# EAGLE design 4-Channel Lora Relay-10A v2.0 (EAGLE 6.1)
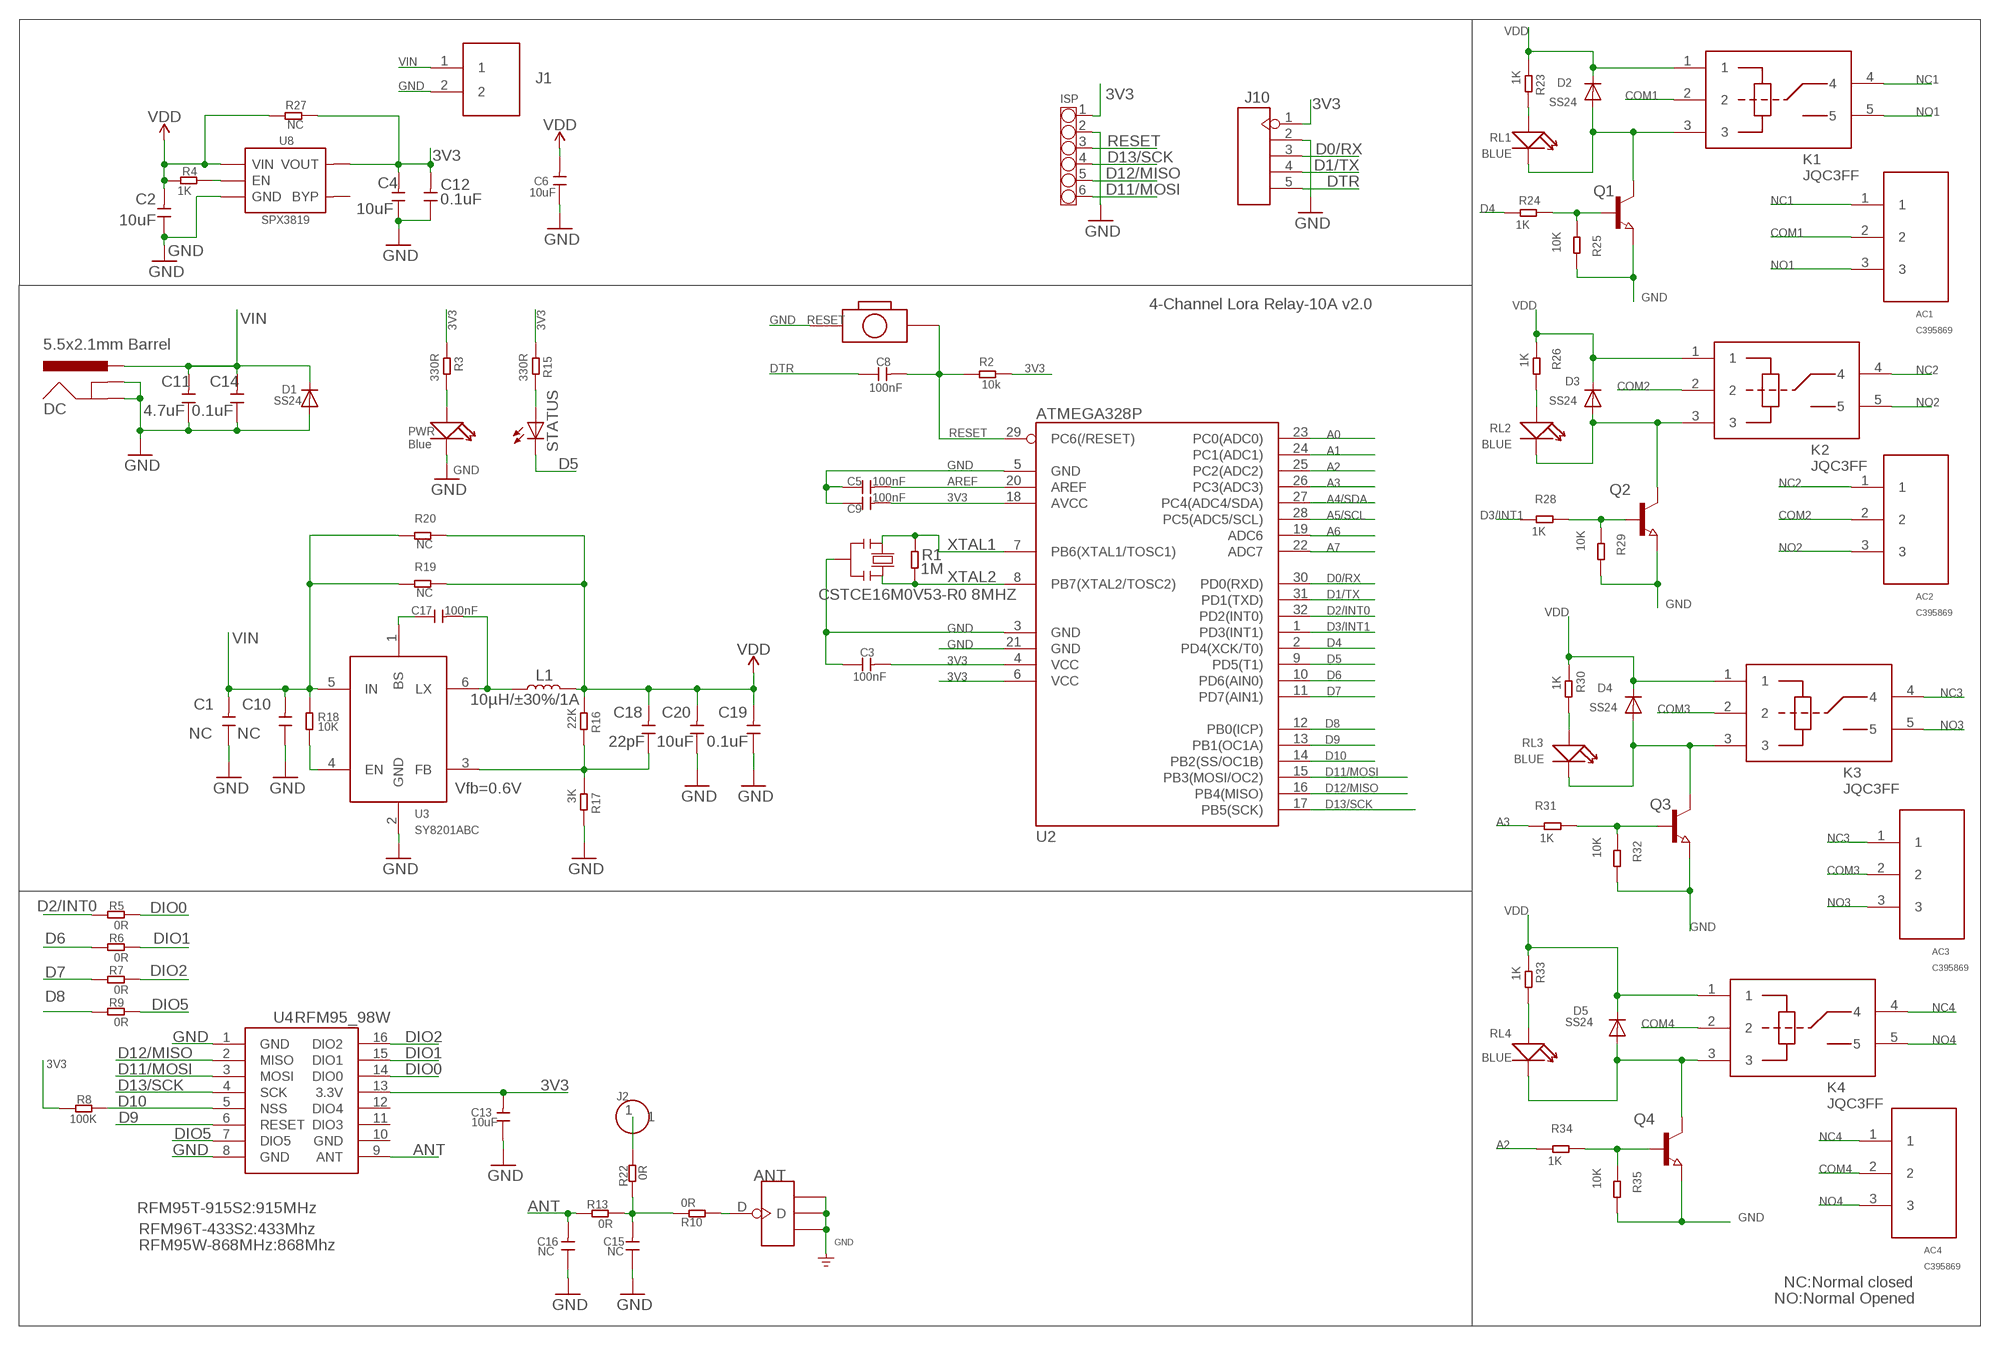
[diagram p0: schematic, sheet 1]

## Parts
AC1  C395869  [PIN_3P]
AC2  C395869  [PIN_3P]
AC3  C395869  [PIN_3P]
AC4  C395869  [PIN_3P]
ANT  ANTENNA-U-FL  [4P-U-FL]
C1  NC  C-0603  [0603]
C2  10uF  C-0603  [0603]
C3  100nF  C-0603  [0603]
C4  10uF  C-0603  [0603]
C5  100nF  C-0603  [0603]
C6  10uF  C-0603  [0603]
C8  100nF  C-0603  [0603]
C9  100nF  C-0603  [0603]
C10  NC  C-0603  [0603]
C11  4.7uF  C-0603  [0603]
C12  0.1uF  C-0603  [0603]
C13  10uF  C-0603  [0603]
C14  0.1uF  C-0603  [0603]
C15  NC  C-0603  [0603]
C16  NC  C-0603  [0603]
C17  100nF  C-0603  [0603]
C18  22pF  C-0603  [0603]
C19  0.1uF  C-0603  [0603]
C20  10uF  C-0603  [0603]
D1  SS24  DIODESMA  [SMADIODE]
D2  SS24  DIODESMA  [SMADIODE]
D3  SS24  DIODESMA  [SMADIODE]
D4  SS24  DIODESMA  [SMADIODE]
D5  SS24  DIODESMA  [SMADIODE]
DC  5.5x2.1mm Barrel  POWER_JACKSMD  [POWER_JACK_SMD]
ISP  CONNECTOR-HEADER-6P-3460270P1  [1X6P-2.54-8.5-BLACK-FEMALE]
J1  PH2.0-2P-90-DIP  [PH2.0-2P-90-DIP]
J2  HEADER-1P-50  [1P-100/50MIL]
J10  HEADER-5P-2.54  [5P-2.54]
K1  JQC3FF  [DIP5_JQC3FF]
K2  JQC3FF  [DIP5_JQC3FF]
K3  JQC3FF  [DIP5_JQC3FF]
K4  JQC3FF  [DIP5_JQC3FF]
L1  10µH/±30%/1A  INDUCTOR-CR54-47UH  [CR54]
PWR  Blue  LED'0603'  [LED-0603]
Q1  NPN-TRANSISTOR_SOT23  [SOT23]
Q2  NPN-TRANSISTOR_SOT23  [SOT23]
Q3  NPN-TRANSISTOR_SOT23  [SOT23]
Q4  NPN-TRANSISTOR_SOT23  [SOT23]
R1  1M  R-0603  [R0603]
R2  10k  R-0603  [R0603]
R3  330R  R-0603  [R0603]
R4  1K  R-0603  [R0603]
R5  0R  R-0603  [R0603]
R6  0R  R-0603  [R0603]
R7  0R  R-0603  [R0603]
R8  100K  R-0603  [R0603]
R9  0R  R-0603  [R0603]
R10  0R  R-0603  [R0603]
R13  0R  R-0603  [R0603]
R15  330R  R-0603  [R0603]
R16  22K  R-0603  [R0603]
R17  3K  R-0603  [R0603]
R18  10K  R-0603  [R0603]
R19  NC  R-0603  [R0603]
R20  NC  R-0603  [R0603]
R22  0R  R-0603  [R0603]
R23  1K  R-0603  [R0603]
R24  1K  R-0603  [R0603]
R25  10K  R-0603  [R0603]
R26  1K  R-0603  [R0603]
R27  NC  R-0603  [R0603]
R28  1K  R-0603  [R0603]
R29  10K  R-0603  [R0603]
R30  1K  R-0603  [R0603]
R31  1K  R-0603  [R0603]
R32  10K  R-0603  [R0603]
R33  1K  R-0603  [R0603]
R34  1K  R-0603  [R0603]
R35  10K  R-0603  [R0603]
RESET  BOTTON-2P-90D  [2P-7.62X3.56-90D]
RL1  BLUE  LED'0603'  [LED-0603]
RL2  BLUE  LED'0603'  [LED-0603]
RL3  BLUE  LED'0603'  [LED-0603]
RL4  BLUE  LED'0603'  [LED-0603]
STATUS  LED5MM  [LED5MM]
U2  ATMEGA328P  ATMEGA8/168/328  [TQFP32]
U3  SY8201ABC  [SOT-23-6]
U4  RFM95_98W  RFM92_93W  [RFM92_93W]
U8  SPX3819  [SOT23-5]
Y1  CSTCE16M0V53-R0 8MHZ  RESONATORMU  [RESONATOR]

## Nets
3V3: C3.2 C4.2 C9.2 C12.2 C13.2 ISP.1 J10.1 R2.1 R3.1 R8.2 R15.1 R27.2 U2.4(VCC) U2.6(VCC) U2.18(AVCC) U4.13(3.3V) U8.5(VOUT)
A0: U2.23(PC0(ADC0))
A1: U2.24(PC1(ADC1))
A2: R34.1 U2.25(PC2(ADC2))
A3: R31.1 U2.26(PC3(ADC3))
A4/SDA: U2.27(PC4(ADC4/SDA))
A5/SCL: U2.28(PC5(ADC5/SCL))
A6: U2.19(ADC6)
A7: U2.22(ADC7)
ANT: C16.2 R13.2 U4.9(ANT)
AREF: C5.2 U2.20(AREF)
COM1: AC1.2 K1.2
COM2: AC2.2 K2.2
COM3: AC3.2 K3.2
COM4: AC4.2 K4.2
D0/RX: J10.3 U2.30(PD0(RXD))
D1/TX: J10.4 U2.31(PD1(TXD))
D2/INT0: R5.1 U2.32(PD2(INT0))
D3/INT1: R28.1 U2.1(PD3(INT1))
D4: R24.1 U2.2(PD4(XCK/T0))
D5: STATUS.K(C) U2.9(PD5(T1))
D6: R6.1 U2.10(PD6(AIN0))
D7: R7.1 U2.11(PD7(AIN1))
D8: R9.1 U2.12(PB0(ICP))
D9: U2.13(PB1(OC1A)) U4.6(RESET)
D10: R8.1 U2.14(PB2(SS/OC1B)) U4.5(NSS)
D11/MOSI: ISP.6 U2.15(PB3(MOSI/OC2)) U4.3(MOSI)
D12/MISO: ISP.5 U2.16(PB4(MISO)) U4.2(MISO)
D13/SCK: ISP.4 U2.17(PB5(SCK)) U4.4(SCK)
DIO0: R5.2 U4.14(DIO0)
DIO1: R6.2 U4.15(DIO1)
DIO2: R7.2 U4.16(DIO2)
DIO5: R9.2 U4.7(DIO5)
DTR: C8.1 J10.5
GND: ANT.GND1 ANT.GND2 ANT.GND3 C1.1 C2.1 C3.1 C4.1 C5.1 C6.1 C9.1 C10.1 C11.1 C12.1 C13.1 C14.1 C15.1 C16.1 C19.1 C20.1 D1.A DC.GND(GNDBREAK) DC.P$4(GND) ISP.2 J1.2 J10.2 PWR.- Q1.2(E) Q2.2(E) Q3.2(E) Q4.2(E) R17.2 R25.2 R29.2 R32.2 R35.2 RESET.P$1 U2.3(GND) U2.5(GND) U2.21(GND) U3.2(GND) U4.1(GND) U4.8(GND) U8.2(GND) Y1.2
N$1: ANT.D R10.2
N$3: R23.2 RL1.+
N$4: C15.2 R10.1 R13.1 R22.2
N$5: R15.2 STATUS.A
N$6: C17.2 L1.P$1 U3.6(LX)
N$7: PWR.+ R3.2
N$8: C17.1 U3.1(BS)
N$9: D2.A K1.3 Q1.3(C) RL1.-
N$10: C18.1 R16.2 R17.1 U3.3(FB)
N$11: R18.2 U3.4(EN)
N$12: J2.1 R22.1
N$14: Q1.1(B) R24.2 R25.1
N$20: R26.2 RL2.+
N$21: D3.A K2.3 Q2.3(C) RL2.-
N$23: Q2.1(B) R28.2 R29.1
N$24: R4.2 U8.3(EN)
N$35: R30.2 RL3.+
N$36: D4.A K3.3 Q3.3(C) RL3.-
N$38: Q3.1(B) R31.2 R32.1
N$47: R33.2 RL4.+
N$48: D5.A K4.3 Q4.3(C) RL4.-
N$53: Q4.1(B) R34.2 R35.1
NC1: AC1.1 K1.4
NC2: AC2.1 K2.4
NC3: AC3.1 K3.4
NC4: AC4.1 K4.4
NO1: AC1.3 K1.5
NO2: AC2.3 K2.5
NO3: AC3.3 K3.5
NO4: AC4.3 K4.5
RESET: C8.2 ISP.3 R2.2 RESET.P$2 U2.29(PC6(/RESET))
VDD: C2.2 C6.2 C18.2 C19.2 C20.2 D2.C D3.C D4.C D5.C K1.1 K2.1 K3.1 K4.1 L1.P$2 R4.1 R16.1 R19.2 R20.2 R23.1 R26.1 R27.1 R30.1 R33.1 U8.1(VIN)
VIN: C1.2 C10.2 C11.2 C14.2 D1.C DC.VIN0(PWR) J1.1 R18.1 R19.1 R20.1 U3.5(IN)
XTAL1: R1.2 U2.7(PB6(XTAL1/TOSC1)) Y1.1
XTAL2: R1.1 U2.8(PB7(XTAL2/TOSC2)) Y1.3
Unconnected: U4.11(DIO3) U4.12(DIO4) U8.4(BYP)

## Notes on the sheet
- J1
- 4-Channel Lora Relay-10A v2.0
- Vfb=0.6V
- RFM95T-915S2:915MHz
- RFM96T-433S2:433Mhz
- RFM95W-868MHz:868Mhz
- NC:Normal closed
- NO:Normal Opened

## Power pins joined to a net without a drawn wire
GND: U4.10(GND)

## Library data of the parts
AC1-AC4 = 1mytest:C395869
ANT = Connector:ANTENNA-U-FL
C1-C6 C8-C20 = Discrete:C*: Ceramic Capacitors
D1-D5 = adafruit:DIODE: Diode SMADIODE - SMA Surface Mount Package 20V 1A Schottky Diode Digikey: 641-1014-6-ND DO-1N4148 - Through Hole Small Current Diode SOD-123 20V 1 A (.5mV Vf) Schottky Diode - Digikey: MBRX120TPMSCT-ND SOD-323 10V 570mA (.38mV Vf, 3ns) Schottky Diode - Digikey: ZLLS410CT-ND SOD-523 30V 30mA Schottky Diode (RB751S-40TE61) - Digikey: RB751S-40TE61CT-ND SOT23-R/W - SOT23 Package (R = Solder Paste/Reflow Ovens, W = Hand-Soldering) BAT54Film 40V 300mA - Digikey: 497-7162-1-ND
DC = SparkFun-Connectors:POWER_JACK: Power Jack Connector This is the standard 5.5mm barrel jack for power. The PTH is the most common, proven, reliable, footprint. The Slot footprint only works if the mill layer is transmitted to the PCB fab house so be warned. Here are the connectors we sell at SparkFun: DC Barrel Power Jack/Connector <https://www.sparkfun.com/products/119> (PRT-00119) DC Barrel Power Jack/Connector (SMD) <https://www.sparkfun.com/products/12748> (PRT-12748) DC Barrel Jack Adapter - Breadboard Compatible <https://www.sparkfun.com/products/10811> (PRT-10811) It is used on this SparkFun product (and many, many others): SparkFun RedBoard - Programmed with Arduino <https://www.sparkfun.com/products/12757> (DEV-12757) Also, if you need a mating power supply or connector, please check these out: Wall Adapter Power Supply - 9VDC 650mA <https://www.sparkfun.com/products/298> (TOL-00298) DC Barrel Jack Adapter - Male <https://www.sparkfun.com/products/10287> (PRT-10287); PROD_ID: CONN-08106; SF_ID: PRT-12748
ISP = OPL Eagle Library:CONNECTOR-HEADER-6P
J1 = Connector:PH2.0-2P-90-DIP
J2 = Connector:HEADER-1P
J10 = Connector:HEADER-5P
K1-K4 = 1mytest:JQC3FF
L1 = SparkFun-Coils:INDUCTOR: Inductors Resist changes in electrical current. Basically a coil of wire. SparkFun Products: SparkFun Load Cell Amplifier - HX711 <https://www.sparkfun.com/products/13879> IOIO-OTG - V2.2 <https://www.sparkfun.com/products/13613>; PROD_ID: NDUC-10789; VALUE: 47µH/±30%/750mA
PWR RL1-RL4 = Discrete:LED*
Q1-Q4 = semicon-smd-ipc:NPN-TRANSISTOR_: NPN TRANSISTOR
R1-R10 R13 R15-R20 R22-R35 = Discrete:R*
RESET = Discrete:BOTTON-2P
STATUS = led:LED: LED OSRAM: - CHIPLED LG R971, LG N971, LY N971, LG Q971, LY Q971, LO R971, LY R971 LH N974, LH R974 LS Q976, LO Q976, LY Q976 LO Q996 - Hyper CHIPLED LW Q18S LB Q993, LB Q99A, LB R99A - SideLED LS A670, LO A670, LY A670, LG A670, LP A670 LB A673, LV A673, LT A673, LW A673 LH A674 LY A675 LS A676, LA A676, LO A676, LY A676, LW A676 LS A679, LY A679, LG A679 - Hyper Micro SIDELED® LS Y876, LA Y876, LO Y876, LY Y876 LT Y87S - SmartLED LW L88C, LW L88S LB L89C, LB L89S, LG L890 LS L89K, LO L89K, LY L89K LS L896, LA L896, LO L896, LY L896 - TOPLED LS T670, LO T670, LY T670, LG T670, LP T670 LSG T670, LSP T670, LSY T670, LOP T670, LYG T670 LG T671, LOG T671, LSG T671 LB T673, LV T673, LT T673, LW T673 LH T674 LS T676, LA T676, LO T676, LY T676, LB T676, LH T676, LSB T676, LW T676 LB T67C, LV T67C, LT T67C, LS T67K, LO T67K, LY T67K, LW E67C LS E67B, LA E67B, LO E67B, LY E67B, LB E67C, LV E67C, LT E67C LW T67C LS T679, LY T679, LG T679 LS T770, LO T770, LY T770, LG T770, LP T770 LB T773, LV T773, LT T773, LW T773 LH T774 LS E675, LA E675, LY E675, LS T675 LS T776, LA T776, LO T776, LY T776, LB T776 LHGB T686 LT T68C, LB T68C - Hyper Mini TOPLED® LB M676 - Mini TOPLED Santana® LG M470 LS M47K, LO M47K, LY M47K Source: http://www.osram.convergy.de LUXEON: - LUMILED® LXK2-PW12-R00, LXK2-PW12-S00, LXK2-PW14-U00, LXK2-PW14-V00 LXK2-PM12-R00, LXK2-PM12-S00, LXK2-PM14-U00 LXK2-PE12-Q00, LXK2-PE12-R00, LXK2-PE12-S00, LXK2-PE14-T00, LXK2-PE14-U00 LXK2-PB12-K00, LXK2-PB12-L00, LXK2-PB12-M00, LXK2-PB14-N00, LXK2-PB14-P00, LXK2-PB14-Q00 LXK2-PR12-L00, LXK2-PR12-M00, LXK2-PR14-Q00, LXK2-PR14-R00 LXK2-PD12-Q00, LXK2-PD12-R00, LXK2-PD12-S00 LXK2-PH12-R00, LXK2-PH12-S00 LXK2-PL12-P00, LXK2-PL12-Q00, LXK2-PL12-R00 Source: www.luxeon.com KINGBRIGHT: KA-3528ASYC Source: www.kingbright.com
U2 = IC:ATMEGA8/168/328: MICROCONTROLLER
U3 = self:SY8201ABC
U4 = dragino:RFM92_93W
U8 = IC:SPX3819
Y1 = SmartPrj:RESONATOR

## Net classes
0 default: width 0.152 mm, drill 0.305 mm, clearance 0.152 mm
2 gnd: width 0.305 mm, drill 0.559 mm, clearance 0.254 mm
3 usbvcc: width 0.508 mm, drill 0.61 mm, clearance 0.254 mm

## Board
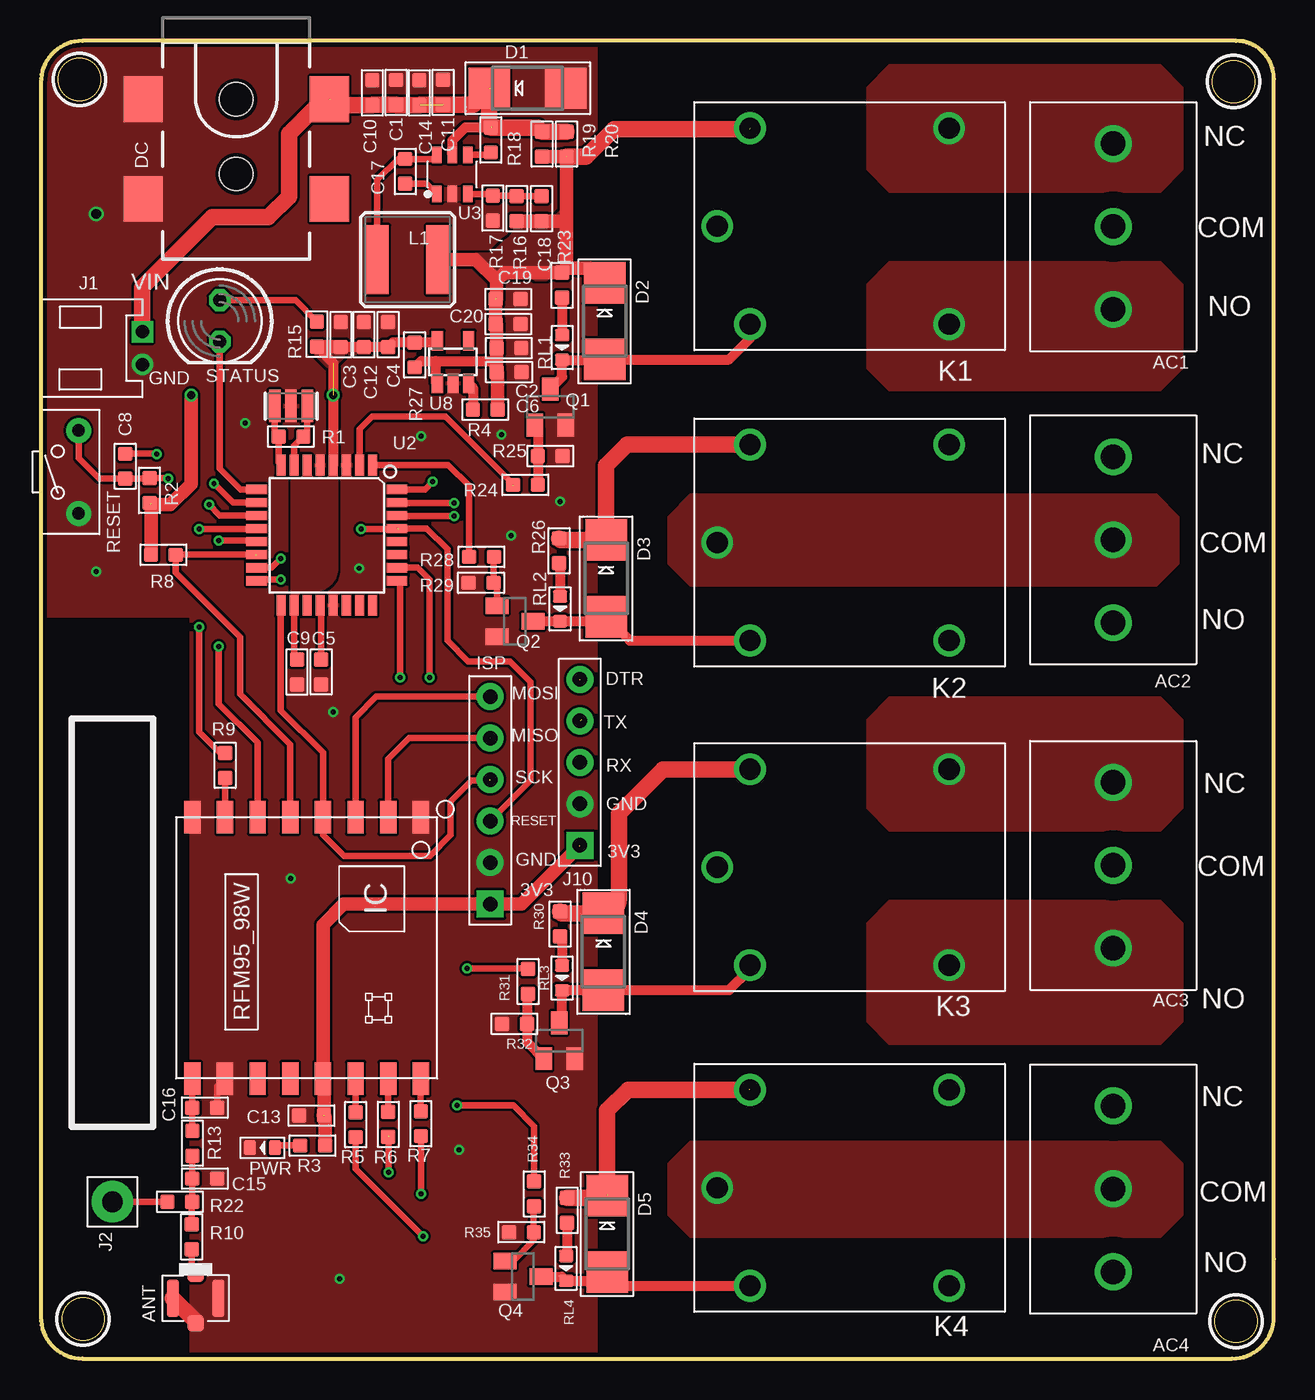
[diagram p1: board, top side]
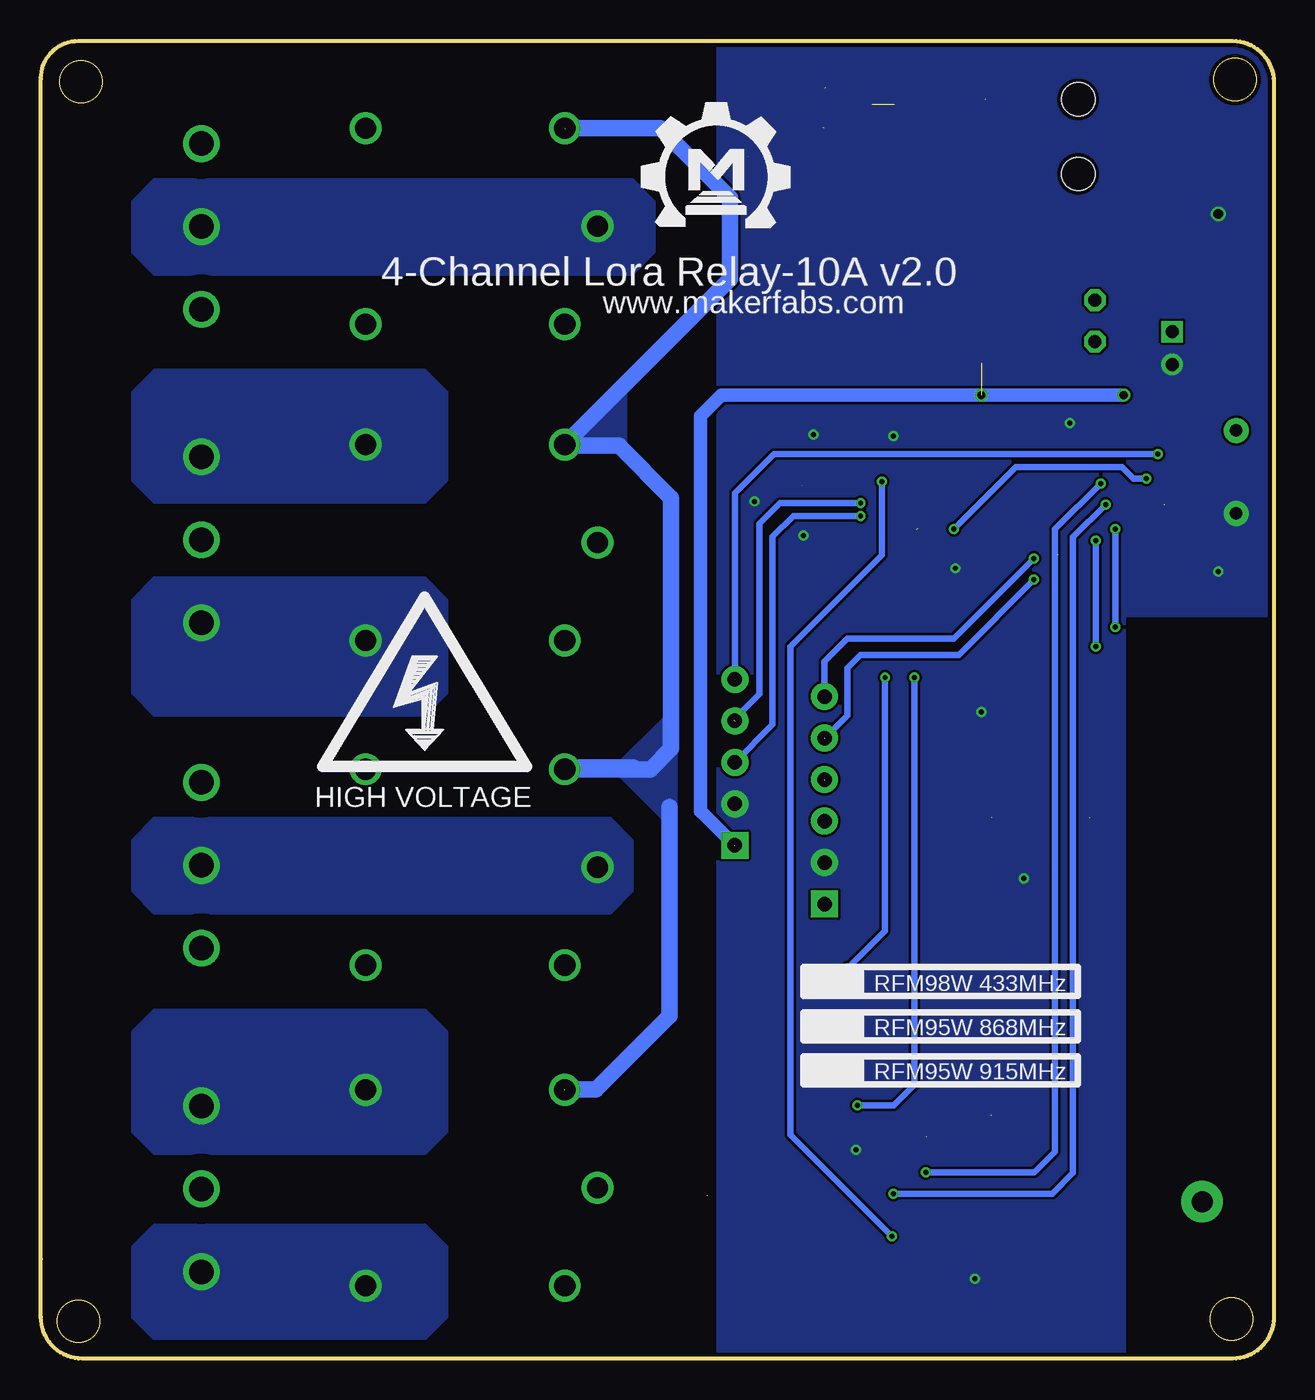
[diagram p2: board, bottom side, seen from below]

Size 75.5 x 80.7 mm. Coordinates in mm from the lower left corner, seen from the top.
Outline: 75.5,6.09 75.5,78.36
Outline: 75.5,78.4 arc90 73.2,80.7 2.54,80.7 arc90 0,78.16 0,2.54 arc90 2.54,0 72.96,0 arc90 75.5,2.54 75.5,6.1
Outline: circle at 2.59,2.43 radius 1.3
Outline: circle at 2.37,78.33 radius 1.3
Outline: circle at 73.04,78.2 radius 1.3
Outline: circle at 73.2,2.29 radius 1.3
Copper layers (1*16): Top 0.035mm / dielectric 1.5mm / Bottom 0.035mm
Design rules: minimum track width 6mil, minimum drill 12mil, track to track 6mil, track to pad 6mil, pad to pad 6mil, via to via 6mil, smd to smd 0mil, copper to edge 10mil, drill to drill 10mil, minimum pad ring 10mil, minimum via ring 6mil, stop-mask expansion 2mil, vias tented up to drill 100mil, thermal gap 0mil
tRestrict: area -118.3,36.8 to -76.7,43; 11 lines
bRestrict: area -118.3,36.6 to -76.5,43; 10 lines

### Footprints (pad centres in the part's own frame; a part is rotated, then mirrored left to right if it is on the bottom)
PIN_3P = drill 1.5: 1 0,10.16; 2 0,5.08; 3 0,0
4P-U-FL = smd 1.016 x 1.016: D -1.524,0; GND3 1.524,0 | smd 2.286 x 0.762: GND1 0,1.397; GND2 0,-1.397
0603 = smd 0.889 x 0.889: 1 -0.762,0; 2 0.762,0
SMADIODE = smd 2.54 x 2.54: A 2.349,0; C -2.349,0
POWER_JACK_SMD = smd 2.8 x 2.4: GND 0,-5.7; P$4 6.1,-5.7; VIN0 0,5.7; VIN1 6.1,5.7 | hole 2.032: 0,0; 4.572,0
1X6P-2.54-8.5-BLACK-FEMALE = drill 0.889 pad 1.651 square: 1 0,6.35 | drill 0.889 pad 1.651: 2 0,3.81; 3 0,1.27; 4 0,-1.27; 5 0,-3.81; 6 0,-6.35
PH2.0-2P-90-DIP = drill 0.8 square: 1 0,1 | drill 0.8: 2 0,-1
1P-100/50MIL = drill 1.27 pad 2.54: 1 0,0
5P-2.54 = drill 0.889 pad 1.651 square: 1 0,5.08 | drill 0.889 pad 1.651: 2 0,2.54; 3 0,0; 4 0,-2.54; 5 0,-5.08
DIP5_JQC3FF = drill 1.3: 1 0,12; 2 -2,6; 3 0,0; 4 12.2,12; 5 12.2,0
CR54 = smd 4.2 x 1.4: P$1 0,1.85; P$2 0,-1.85
LED-0603 = smd 0.762 x 0.889: + -0.762,0; - 0.762,0
SOT23 = smd 1 x 1.4: 1 -0.95,-1.1; 2 0.95,-1.1; 3 0,1.1
R0603 = smd 0.889 x 0.889: 1 -0.762,0; 2 0.762,0
2P-7.62X3.56-90D = drill 0.762 pad 1.524: P$1 0,2.54; P$2 0,-2.54
LED5MM = drill 0.813 octagon: A -1.27,0; K 1.27,0
TQFP32 = smd 1.27 x 0.559: 1 -4.293,2.8; 2 -4.293,2; 3 -4.293,1.2; 4 -4.293,0.4; 5 -4.293,-0.4; 6 -4.293,-1.2; 7 -4.293,-2; 8 -4.293,-2.8; 17 4.293,-2.8; 18 4.293,-2; 19 4.293,-1.2; 20 4.293,-0.4; 21 4.293,0.4; 22 4.293,1.2; 23 4.293,2; 24 4.293,2.8 | smd 0.559 x 1.27: 9 -2.8,-4.293; 10 -2,-4.293; 11 -1.2,-4.293; 12 -0.4,-4.293; 13 0.4,-4.293; 14 1.2,-4.293; 15 2,-4.293; 16 2.8,-4.293; 25 2.8,4.293; 26 2,4.293; 27 1.2,4.293; 28 0.4,4.293; 29 -0.4,4.293; 30 -1.2,4.293; 31 -2,4.293; 32 -2.8,4.293
SOT-23-6 = smd 1 x 0.6: 1 -1.2,0.95; 2 -1.2,0; 3 -1.2,-0.95; 4 1.2,-0.95; 5 1.2,0; 6 1.2,0.95
RFM92_93W = smd 2 x 1: 1 -8,7; 2 -8,5; 3 -8,3; 4 -8,1; 5 -8,-1; 6 -8,-3; 7 -8,-5; 8 -8,-7; 9 8,-7; 10 8,-5; 11 8,-3; 12 8,-1; 13 8,1; 14 8,3; 15 8,5; 16 8,7
SOT23-5 = smd 0.69 x 1.2: 1 -0.95,-1.3; 2 0,-1.3; 3 0.95,-1.3; 4 0.95,1.3; 5 -0.95,1.3
RESONATOR = smd 0.7 x 2: 1 -1,0; 2 0,0; 3 1,0

### Placement (x,y rotation side)
AC1  65.68,64.25 0 top
AC2  65.68,45.07 0 top
AC3  65.68,25.13 0 top
AC4  65.68,5.32 0 top
ANT  9.48,3.7 270 top
C1  21.75,77.54 270 top
C2  28.66,61.89 180 top
C3  18.37,62.71 270 top
C4  21.26,62.71 270 top
C5  17.16,42.05 90 top
C6  28.67,60.41 180 top
C8  5.17,54.65 270 top
C9  15.69,42.05 90 top
C10  20.3,77.52 270 top
C11  24.63,77.54 270 top
C12  19.78,62.71 270 top
C13  16.57,14.89 0 top
C14  23.18,77.51 270 top
C15  10.04,11.03 180 top
C16  10.04,15.37 180 top
C17  22.31,72.7 90 top
C18  30.67,70.42 270 top
C19  28.62,64.88 180 top
C20  28.62,63.35 180 top
D1  29.81,77.8 0 top
D2  34.52,63.53 270 top
D3  34.61,47.78 270 top
D4  34.45,24.92 270 top
D5  34.67,7.65 270 top
DC  11.97,77.12 270 top
ISP  27.51,34.19 180 top
J1  6.22,61.88 0 top
J2  4.38,9.61 90 top
J10  33.01,36.52 180 top
K1  43.42,63.35 0 top
K2  43.42,43.97 0 top
K3  43.42,24.09 0 top
K4  43.42,4.47 0 top
L1  22.46,67.3 90 top
PWR  13.57,12.92 180 top
Q1  31.2,58.27 0 top
Q2  29.04,45.16 270 top
Q3  31.75,19.47 0 top
Q4  29.52,5.02 270 top
R1  15.32,56.47 0 top
R2  6.66,53.17 90 top
R3  16.64,13.05 180 top
R4  27.22,58.12 180 top
R5  19.27,14.33 90 top
R6  21.27,14.34 90 top
R7  23.27,14.39 90 top
R8  7.51,49.23 180 top
R9  11.28,36.33 270 top
R10  9.24,7.46 270 top
R13  9.28,13.19 90 top
R15  16.9,62.74 90 top
R16  29.14,70.42 90 top
R17  27.68,70.46 270 top
R18  27.56,74.63 270 top
R19  32.2,74.38 270 top
R20  30.69,74.38 270 top
R22  8.51,9.61 0 top
R23  31.92,65.73 270 top
R24  29.67,53.51 0 top
R25  31.2,55.26 0 top
R26  31.73,49.47 270 top
R27  22.89,61.46 90 top
R28  26.98,49.1 0 top
R29  26.96,47.51 180 top
R30  31.79,26.61 270 top
R31  29.83,23.09 270 top
R32  29,20.49 180 top
R33  32.23,9.09 270 top
R34  30.21,10.09 270 top
R35  29.42,7.75 180 top
RESET  2.31,54.3 180 top
RL1  31.93,61.92 270 top
RL2  31.8,45.92 270 top
RL3  31.92,23.31 270 top
RL4  32.17,5.53 270 top
STATUS  10.95,63.55 270 top
U2  17.51,50.43 270 top
U3  25.2,72.52 90 top
U4  16.27,25.15 270 top
U8  25.24,61.03 0 top
U$1  [MAKERFABS_0.3]  38.27,69.3 0 bottom
U$3  [HIGH-VOLTAGE-1.5]  52,39.4 0 bottom
Y1  15.32,58.34 180 top

### Tracks (layer width: path | path; a pad name or v marks a point on that pad's centre or on a via)
3V3  (via drill 0.5)  (4 unrouted)
  Top 0.406: U2.18 15.51,42.99 C9.2
  Top 0.61: U8.5 24.19,62.23 R27.2 21.55,62.23 C4.2 C12.2 C3.2 | R15.1 16.94,61.94 17.91,60.97 U2.4
  Top 0.813: R3.1 17.4,14.8 17.3,14.9 | C13.2 17.33,17.09 U4.13 17.27,26.57 18.54,27.84 ISP.1 29.44,27.84 33,31.4 | R8.2 6.74,52.32 R2.1 | 16.94,61.94 16.9,61.9 | v9.2,59 9.2,53.57 7.93,52.3 6.7,52.3 | C3.2 18.33,61.98 R15.1
  Bottom 0.813: v9.2,59 v17.9,59 33.83,59 35.1,57.73 35.1,33.5 35.07,33.5 J10.1
  pour Top (isolate 0.813): 16.7,61.7 17.6,60.8 17.9,60.8 18.7,61.6 19.4,61.6 19.5,61.7 19.5,61.8 16.7,61.8
  pour Top: 16,54.2 arc90 15.4,53.6 15.4,46.6 16,46.6 16,47.1 16.8,47.1 arc90 18.1,48.4 18.1,54.1 arc90 18,54.2
A2  (via drill 0.3)
  Top 0.406: U2.25 22,47.44 v22,41.7 | v25.5,15.5 28.94,15.5 30.21,14.23 R34.1
  Bottom 0.406: v22,41.7 22,16.77 23.27,15.5 v25.5,15.5
A3  (via drill 0.3)
  Top 0.406: U2.26 23.07,48.43 23.8,47.7 v23.8,41.7 | v26.1,23.9 29.79,23.9 R31.1
  Bottom 0.406: v23.8,41.7 23.8,26.2 v26.1,23.9
ANT
  Top 0.406: U4.9 C16.2 R13.2
AREF
  Top 0.406: U2.20 17.16,46.14 C5.2
COM1
  pour Bottom (isolate 1.016, rank 3): 65.73,72.09 68.52,72.09 69.79,70.82 69.79,69.3 69.79,67.78 68.52,66.51 65.73,66.51 39.31,66.51 38.04,67.78 38.04,69.3 38.04,70.82 39.31,72.09
COM2
  pour Top (isolate 1.016, rank 3): 65.73,52.79 68.27,52.79 69.54,51.52 69.54,50 69.54,48.73 68.27,47.46 65.73,47.46 39.82,47.46 38.55,48.73 38.55,50 38.55,51.52 39.82,52.79
COM3
  pour Bottom (isolate 1.016, rank 3): 40.66,32.98 68.52,32.98 69.79,31.71 69.79,28.66 68.52,27.39 40.66,27.39 39.39,28.66 39.39,31.71
COM4
  pour Top (isolate 1.016, rank 3): 65.73,13.17 68.52,13.17 69.79,11.9 69.79,10.63 69.79,8.85 68.52,7.58 65.73,7.58 39.82,7.58 38.55,8.85 38.55,10.37 38.55,11.9 39.82,13.17
D0/RX  (via drill 0.3)
  Top 0.406: U2.30 arc90 21.84,51.6 v25.3,51.6
  Bottom 0.406: v25.3,51.6 29.43,51.6 30.7,50.33 30.7,38.83 J10.3
D1/TX  (via drill 0.3)  (1 unrouted)
  Top 0.406: U2.31 21.84,52.4 v25.3,52.4
  Bottom 0.406: v25.3,52.4 30.23,52.4 31.5,51.13 31.5,40.7 33.1,39.1
D2/INT0  (via drill 0.3)
  Top 0.406: U2.32 23.53,53.23 v24,53.7 | v23.4,7.5 19.27,11.63 R5.1
  Bottom 0.406: v24,53.7 24,49.2 29.6,43.6 29.6,13.7 v23.4,7.5
D3/INT1
  Top 0.406: U2.1 24.95,54.73 26.22,53.46 R28.1
D4  (1 unrouted)
  Top 0.406: U2.2 19.51,56.91 20.3,57.7 24.8,57.7 28.9,53.6 R24.1
D5
  Top 0.406: U2.9 12.22,53.23 10.95,54.5 STATUS.K
D6  (via drill 0.3)  (1 unrouted)
  Top 0.406: U2.10 11.77,52.43 v10.6,53.6 | v21.3,11.4 21.3,13.6
  Bottom 0.406: v10.6,53.6 13.4,50.8 13.4,12.67 14.67,11.4 v21.3,11.4
D7  (via drill 0.3)
  Top 0.406: U2.11 10.97,51.63 v10.3,52.3 | v23.3,10.1 23.3,13.6 R7.1
  Bottom 0.406: v10.3,52.3 12.3,50.3 12.3,11.37 13.57,10.1 v23.3,10.1
D8  (via drill 0.3)
  Top 0.406: U2.12 13.18,50.8 v9.7,50.8 | v9.7,44.8 9.7,38.36 10.97,37.09 R9.1
  Bottom 0.406: v9.7,50.8 v9.7,44.8
D9  (via drill 0.3)
  Top 0.406: U2.13 13.15,50.1 v10.9,50.1 | v10.9,43.6 10.9,40.1 13.27,37.72 U4.6
  Bottom 0.406: v10.9,50.1 v10.9,43.6
D10  (1 unrouted)
  Top 0.406: 13.2,49.2 13.3,49.2 13.27,49.23 R8.1 8.27,48.13 12.2,44.2 12.2,40.7 15.27,37.62 U4.5
D11/MOSI  (via drill 0.3)
  Top 0.406: U4.3 19.27,39.27 20.54,40.54 ISP.6 | U2.15 14.13,48.43 v14.7,49
  Bottom 0.406: v14.7,49 19.6,44.1 26.1,44.1 27.51,42.68 ISP.6
D12/MISO  (via drill 0.3)  (1 unrouted)
  Top 0.406: U4.2 21.27,36.73 22.54,38 ISP.5 | U2.16 13.28,47.7 v14.7,47.7
  Bottom 0.406: v14.7,47.7 19.3,43.1 25.3,43.1 26.1,42.3 26.1,39.4 27.5,38
D13/SCK  (2 unrouted)
  Top 0.406: U4.4 17.27,37.12 14.7,39.7 U2.17 | 17.3,33.1 17.3,32.07 18.57,30.8 23.83,30.8 25.1,32.07 25.1,34.13 26.37,35.4 27.5,35.4
DIO0
  Top 0.406: U4.14 arc90 U4.14 R5.2
DIO1
  Top 0.406: U4.15 R6.2
DIO2
  Top 0.406: U4.16 arc90 U4.16 R7.2
DIO5  (1 unrouted)
  Top 0.406: R9.2 11.28,33.12 11.3,33.1 11.3,33.2
DTR  (via drill 0.3)  (1 unrouted)
  Top 0.406: C8.1 v7.09,55.41 v7.1,55.4
  Bottom 0.406: J10.5 33,53 30.6,55.4 v7.1,55.4
GND  (via drill 0.3, 0.6)
  Top 0.406: U4.10 10.8,16.68 C16.1
  Top 1.016: ANT.GND2 9.48,2.3 ANT.GND3
  other vias: 3.4,70.1 12.5,57.3 23.3,56.5 28.2,56.6 31.8,52.5 28.8,50.4 19.5,48.4 3.4,48.2 17.9,39.6 15.3,29.4 25.6,12.8 18.3,4.9
  pour Top (rank 6): 0,76.7 0,45.5 6,45.5 9.2,45.5 9.2,32.4 9.2,0 17.2,0 34,0 34,24.8 34,80.7 19.2,80.7 0,80.7
  pour Bottom (rank 6): 0,80.7 0,45.5 4.2,45.5 9.2,45.5 9.2,26 9.2,0 18.4,0 34,0 34,17.3 34,80.7 19.2,80.7
N$1
  Top 0.406: R10.2 9.24,5.22 ANT.D
N$3
  Top 0.61: R23.2 RL1.+
N$4
  Top 0.406: R13.1 C15.2 R22.2 9.24,9.57 R10.1
N$5
  Top 0.406: R15.2 15.59,64.82 STATUS.A
N$6
  Top 0.406: U3.6 arc-90 24,73.46 C17.2 21.88,73.46 20.61,72.19 L1.P$1
N$7
  Top 0.406: PWR.+ 14.33,13.05 R3.2
N$8
  Top 0.406: C17.1 23.62,71.94 U3.1
N$9
  Top 0.61: Q1.3 31.93,60.11 RL1.- 34.5,61.16 D2.A 42.15,61.18 43.42,62.45 K1.3
N$10
  Top 0.406: U3.3 27.58,71.32 R17.1 29.11,71.22 R16.2 C18.1
N$11
  Top 0.406: U3.4 27.41,73.72 R18.2
N$12
  Top 0.406: R22.1 J2.1
N$14
  Top 0.61: Q1.1 30.43,56.99 R25.1 R24.2
N$20
  Top 0.61: R26.2 31.8,48.64 RL2.+
N$21
  Top 0.61: Q2.3 RL2.- 34.34,45.16 D3.A 36.07,43.97 K2.3
N$23
  Top 0.406: R28.2 27.72,49.07 R29.1 27.94,47.29 Q2.1
  Top 0.61: Q2.1 27.75,45.92
N$24
  Top 0.61: U8.3 26.46,59.46 R4.2
N$35
  Top 0.61: R30.2 31.92,25.72 RL3.+
N$36
  Top 0.61: Q3.3 31.92,20.74 RL3.- 31.94,22.57 D4.A 42.15,22.57 43.42,23.84 K3.3
N$38
  Top 0.61: R31.2 29.77,22.27 R32.1 29.77,19.4 Q3.1
N$47
  Top 0.61: R33.2 32.23,6.36 RL4.+
N$48
  Top 0.61: Q4.3 31.91,5.02 RL4.- 34.14,4.77 D5.A 35.5,4.47 K4.3
N$53
  Top 0.406: R34.2 arc90 30.19,9.3 R35.1 30.19,7.24 28.92,5.97 Q4.1
NC1
  pour Top (isolate 1.016, rank 3): 50.74,77.8 50.74,72.86 52.01,71.59 68.52,71.59 69.79,72.86 69.79,77.8 68.52,79.07 52.01,79.07
NC2
  pour Bottom (isolate 1.016, rank 3): 52.01,60.42 68.52,60.42 69.79,59.15 69.79,53.81 68.52,52.54 52.01,52.54 50.74,53.81 50.74,59.15
NC3
  pour Top (isolate 1.016, rank 3): 52.01,40.36 68.52,40.36 69.79,39.09 69.79,33.74 68.52,32.47 52.01,32.47 50.74,33.74 50.74,39.09
NC4
  pour Bottom (isolate 1.016, rank 3): 52.01,21.25 68.52,21.25 69.79,19.98 69.79,13.93 68.52,12.66 52.01,12.66 50.74,13.93 50.74,19.98
NO1
  pour Top (isolate 1.016, rank 3): 52.01,67.01 68.52,67.01 69.79,65.74 69.79,60.7 68.52,59.43 52.01,59.43 50.74,60.7 50.74,65.74
NO2
  pour Bottom (isolate 1.016, rank 3): 52.01,47.71 68.52,47.71 69.79,46.44 69.79,40.79 68.52,39.52 52.01,39.52 50.74,40.79 50.74,46.44
NO3
  pour Top (isolate 1.016, rank 3): 52.01,27.9 68.52,27.9 69.79,26.63 69.79,20.68 68.52,19.41 52.01,19.41 50.74,20.68 50.74,26.63
NO4
  pour Bottom (isolate 1.016, rank 3): 52.01,8.09 68.52,8.09 69.79,6.82 69.79,2.57 68.52,1.3 52.01,1.3 50.74,2.57 50.74,6.82
RESET  (via drill 0.3)  (1 unrouted)
  Top 0.406: RESET.P$2 2.31,55.16 3.58,53.89 C8.2 6.66,53.89 R2.2 7.8,53.93 v7.8,53.9 7.77,53.93 | v19.6,50.8 21.9,50.8 | U2.29 23.63,50.83 24.9,49.56 24.9,43.97 26.17,42.7 28.73,42.7 30,41.43 30,35.4 ISP.3
  Bottom 0.406: v7.8,53.9 8.6,53.9 9.3,54.6 15.8,54.6 v19.6,50.8
VDD  (5 unrouted)
  Top 0.61: R27.1 23.29,61.1 24.2,61.1 | 24.2,61.1 27.91,61.1 | U8.1 arc-90 24.2,59.82 24.2,61.1
  Top 0.813: R20.2 R19.2 32.2,69.6 | 32.2,66.77 R23.1 28.39,66.49 27.9,66 | 32.2,66.77 32.2,69.6 | R16.1 30.56,69.66 30.6,69.7 30.63,69.7 C18.2 32.14,69.66 32.2,69.6 | L1.P$2 26.63,67.3 27.9,66.03 27.9,66 | 32.2,66.77 33.63,66.77 D2.C | 27.9,66 27.9,64.9 27.86,64.86 C20.2 27.9,63.32 C2.2 27.91,61.87 27.91,61.1 C6.2 27.98,60.34 R4.1
  Top 1.016: R33.1 34.65,9.85 34.7,9.9 34.6,10 34.7,10 | D5.C 34.67,15.2 35.94,16.47 K4.1 | R30.1 31.9,27.27 D4.C arc90 35.4,28.22 35.4,33.4 38.09,36.09 K3.1 | R26.1 31.83,50.13 D3.C 34.61,54.7 35.88,55.97 K2.1 | 43.4,75.3 35.1,75.3 33.4,73.6 32.2,73.6
  Bottom 1.016: 39.2,36.2 43.32,36.2 K3.1 38.17,36.09 36.9,37.36 36.9,52.7 40.1,55.9 43.3,55.9 | 37,33.8 37,21 41.5,16.5 43.4,16.5 | K2.1 33.3,66.1 33.3,71.1 37.55,75.35 K1.1
  pour Bottom (isolate 0.813): 36.9,38.9 37,38.8 37,33.2 39.9,36.1 37,39 36.9,39
  pour Top (isolate 0.813): 26.6,67.2 27.7,66.1 32.2,66.1 32.3,66.2 32.3,67.7 32.2,67.6 26.6,67.6
  pour Top (isolate 0.813): 26.7,67.6 27.63,67.6 28.9,68.87 28.9,69.5 30.63,69.5 31.9,70.77 31.9,70.8 32.2,70.5 32.2,67.4 26.7,67.4
  pour Bottom: 39.3,59.7 39.7,59.7 43.5,55.9 39.8,55.9 39.8,59.2
VIN  (4 unrouted)
  Top 0.61: U3.5 25.2,74.12 25.2,74.6 26,75.4 27.6,75.4
  Top 1.016: J1.1 6.22,65.62 10.5,69.9 13.93,69.9 15.2,71.17 15.2,75 17.3,77.1 17.7,77.1 18.04,76.76 C10.2 20.32,76.78 C1.2 21.78,76.75 C14.2 23.23,76.8 26.5,76.8 27.5,77.8 | D1.C 27.46,75.49 R18.1 30.44,75.39 R20.1 R19.1
XTAL1
  Top 0.406: Y1.1 16.32,56.71 R1.2 15.51,55.9 U2.7
XTAL2
  Top 0.406: Y1.3 14.32,56.7 R1.1 14.55,54.88 U2.8

### Text on the board
tPlace: NC | COM | VIN | NO | GND | NC | COM | NO | DTR | MOSI | MISO | TX | RX | SCK | NC | RESET | GND | 3V3 | GND | COM | 3V3 | NO | NC | COM | NO
bPlace: 4-Channel Lora Relay-10A v2.0 | www.makerfabs.com | RFM98W 433MHz | RFM95W 868MHz | RFM95W 915MHz